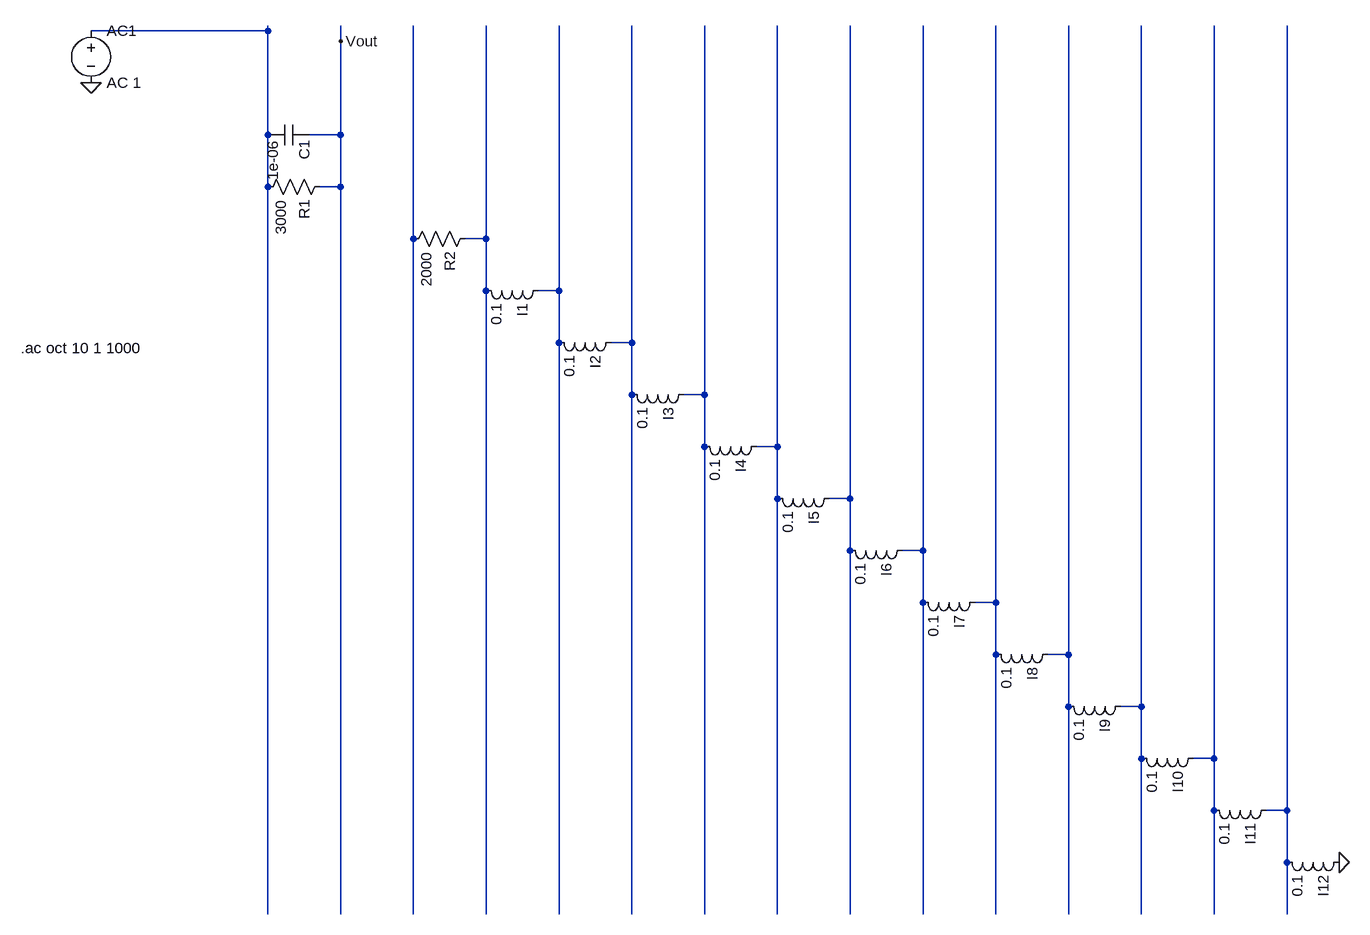
[diagram p0: schematic debug_circuit.asc]
debug_circuit.asc, the LTspice schematic file:
Version 4
SHEET 1 880 680
SYMBOL voltage -272 -176 R0
WINDOW 123 0 0 Left 0
WINDOW 39 0 0 Left 0
SYMATTR InstName AC1
SYMATTR Value AC 1
FLAG -272 -80 0
WIRE 0 -160 -272 -160
TEXT -380 328 Left 2 !.ac oct 10 1 1000
FLAG 112 -144 Vout
WIRE 0 -168 0 1200
WIRE 112 -168 112 1200
WIRE 224 -168 224 1200
WIRE 336 -168 336 1200
WIRE 448 -168 448 1200
WIRE 560 -168 560 1200
WIRE 672 -168 672 1200
WIRE 784 -168 784 1200
WIRE 896 -168 896 1200
WIRE 1008 -168 1008 1200
WIRE 1120 -168 1120 1200
WIRE 1232 -168 1232 1200
WIRE 1344 -168 1344 1200
WIRE 1456 -168 1456 1200
WIRE 1568 -168 1568 1200
SYMBOL cap 64 -16 R90
SYMATTR InstName C1
SYMATTR Value 1e-06
SYMBOL res 96 64 R90
SYMATTR InstName R1
SYMATTR Value 3000
SYMBOL res 320 144 R90
SYMATTR InstName R2
SYMATTR Value 2000
SYMBOL ind 432 224 R90
SYMATTR InstName I1
SYMATTR Value 0.1
SYMBOL ind 544 304 R90
SYMATTR InstName I2
SYMATTR Value 0.1
SYMBOL ind 656 384 R90
SYMATTR InstName I3
SYMATTR Value 0.1
SYMBOL ind 768 464 R90
SYMATTR InstName I4
SYMATTR Value 0.1
SYMBOL ind 880 544 R90
SYMATTR InstName I5
SYMATTR Value 0.1
SYMBOL ind 992 624 R90
SYMATTR InstName I6
SYMATTR Value 0.1
SYMBOL ind 1104 704 R90
SYMATTR InstName I7
SYMATTR Value 0.1
SYMBOL ind 1216 784 R90
SYMATTR InstName I8
SYMATTR Value 0.1
SYMBOL ind 1328 864 R90
SYMATTR InstName I9
SYMATTR Value 0.1
SYMBOL ind 1440 944 R90
SYMATTR InstName I10
SYMATTR Value 0.1
SYMBOL ind 1552 1024 R90
SYMATTR InstName I11
SYMATTR Value 0.1
SYMBOL ind 1664 1104 R90
SYMATTR InstName I12
SYMATTR Value 0.1
WIRE 64 0 112 0
WIRE 80 80 112 80
WIRE 304 160 336 160
WIRE 416 240 448 240
WIRE 528 320 560 320
WIRE 640 400 672 400
WIRE 752 480 784 480
WIRE 864 560 896 560
WIRE 976 640 1008 640
WIRE 1088 720 1120 720
WIRE 1200 800 1232 800
WIRE 1312 880 1344 880
WIRE 1424 960 1456 960
WIRE 1536 1040 1568 1040
FLAG 1648 1120 0

The netlist it stands for:
* debug_circuit.asc
V§AC1 N001 0 AC 1
C1 Vout N001 1e-06
R1 Vout N001 3000
R2 N003 N002 2000
L§I1 N004 N003 0.1
L§I2 N005 N004 0.1
L§I3 N006 N005 0.1
L§I4 N007 N006 0.1
L§I5 N008 N007 0.1
L§I6 N009 N008 0.1
L§I7 N010 N009 0.1
L§I8 N011 N010 0.1
L§I9 N012 N011 0.1
L§I10 N013 N012 0.1
L§I11 N014 N013 0.1
L§I12 0 N014 0.1
.ac oct 10 1 1000
.backanno
.end